# Altium schematic sheet USB 2 High Speed (OTG).SchDoc: USB 2.0 High speed (OTG)
size A3; DocumentNumber: 8; Revision: A; SheetNumber: 8; SheetTotal: 10
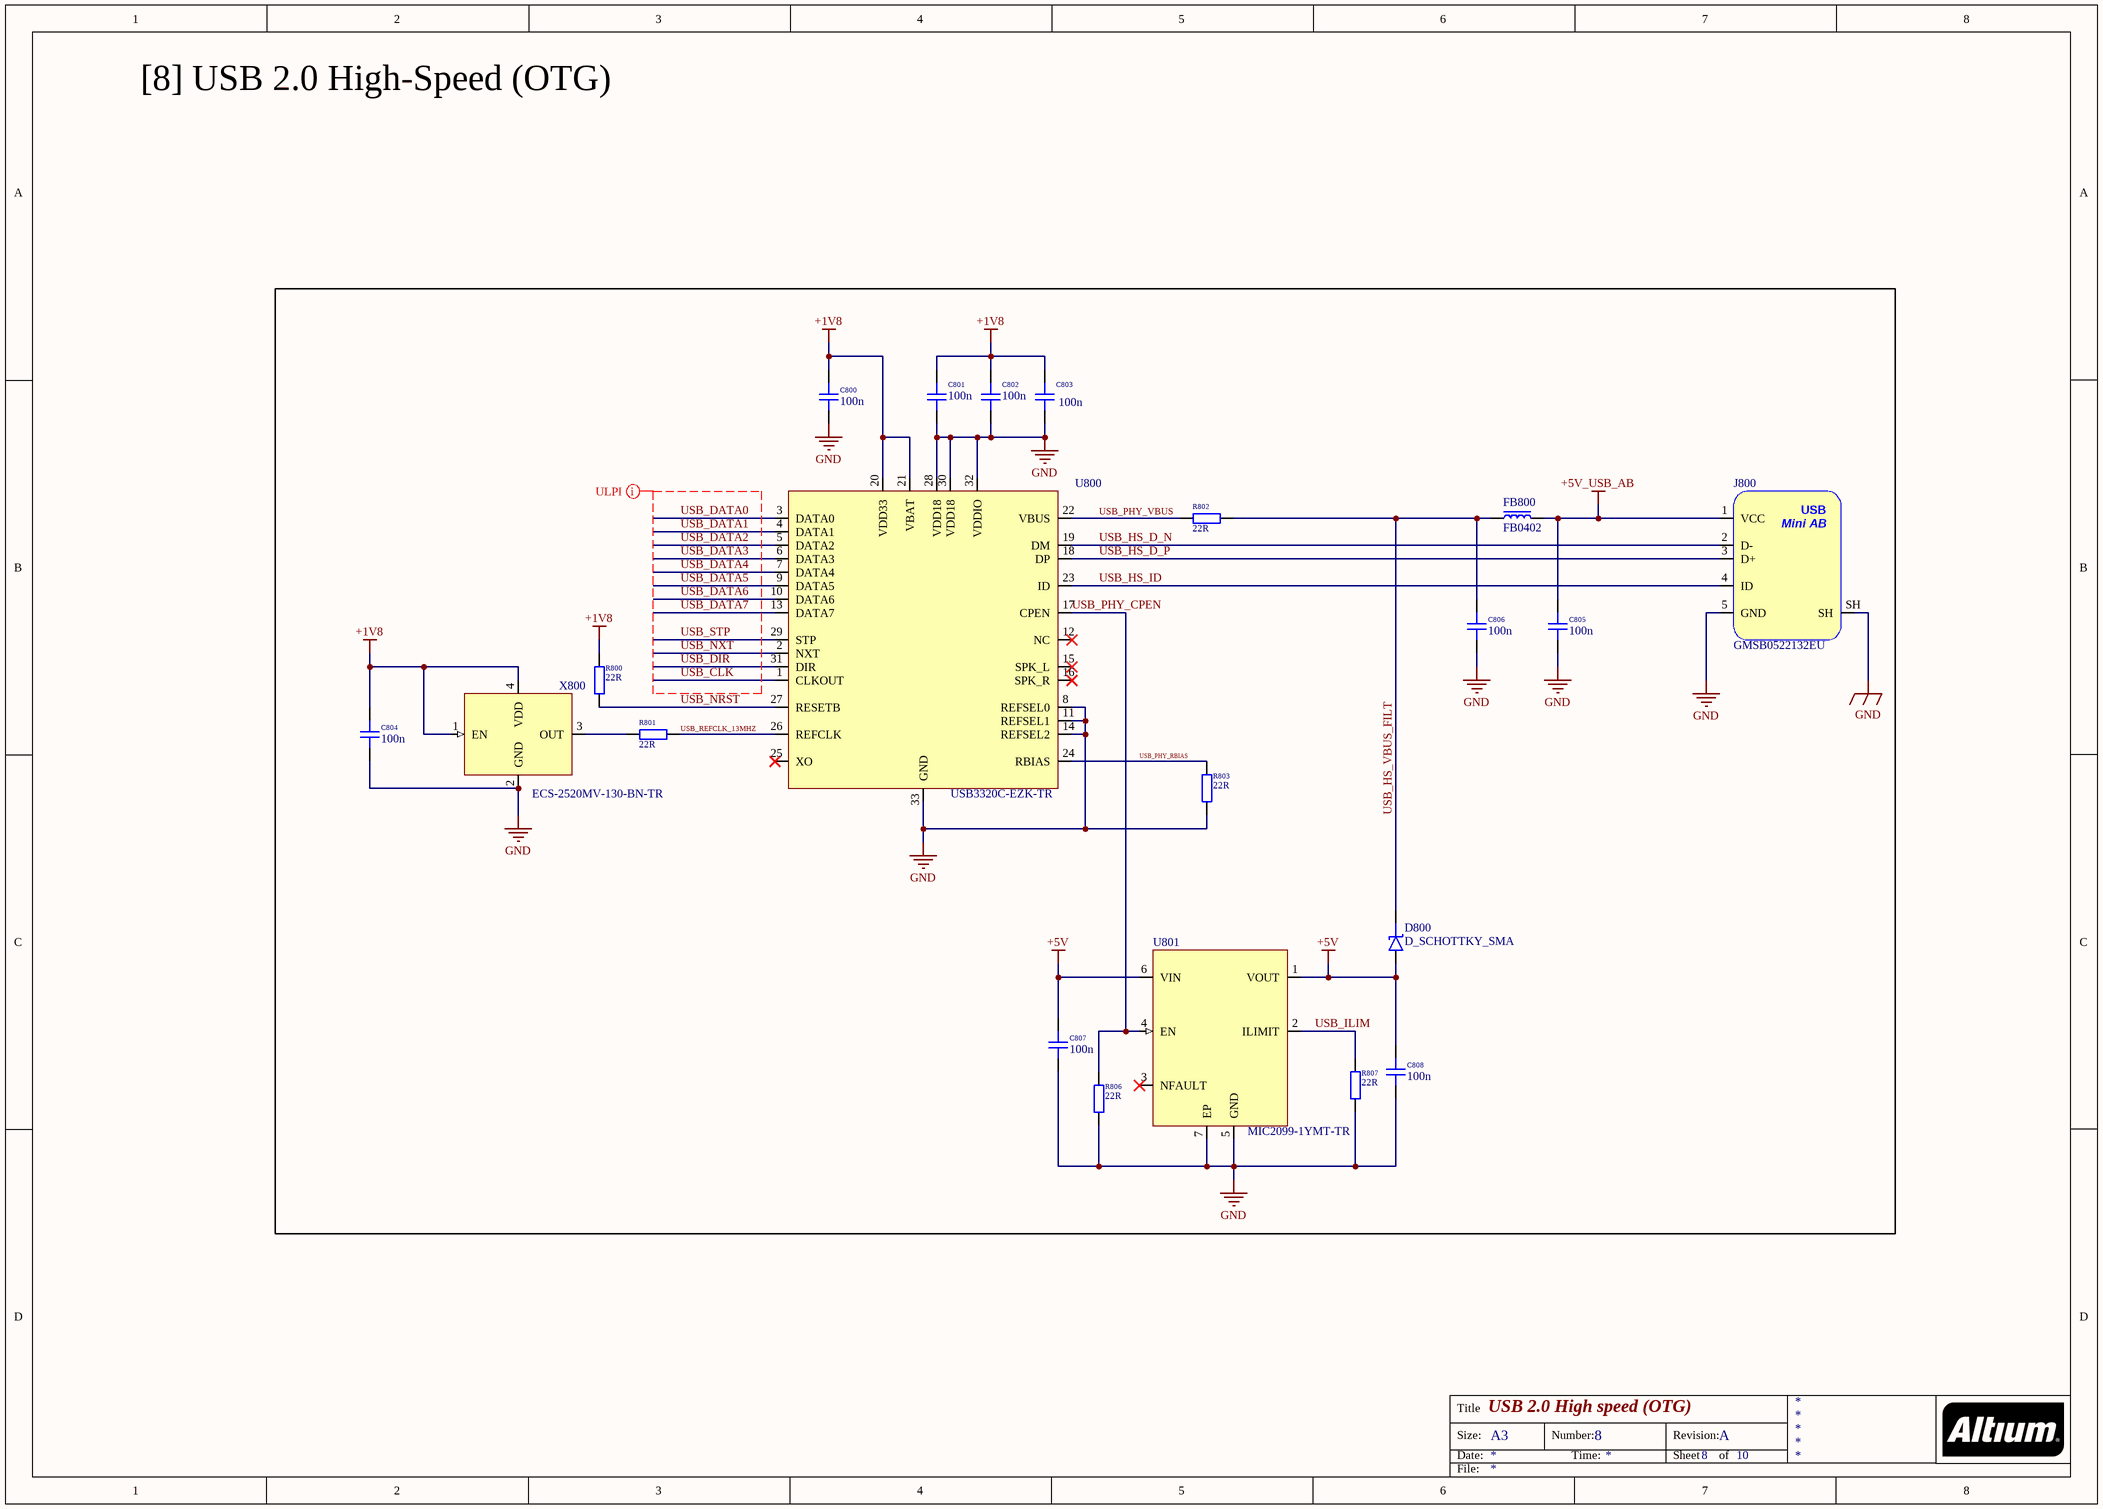
[diagram p0: USB 2 High Speed (OTG).SchDoc]

## Parts
C800  100n  [CAP_1210]
C801  100n  [CAP_1210]
C802  100n  [CAP_1210]
C803  100n  [CAP_1210]
C804  100n  [CAP_1210]
C805  100n  [CAP_1210]
C806  100n  [CAP_1210]
C807  100n  [CAP_1210]
C808  100n  [CAP_1210]
D800  D_SCHOTTKY_SMA  [DO-214AC-2 (SMA)]
FB800  FB0402  [FB_0402]
J800  GMSB0522132EU  [GMSB0522132EU]
R800  22R  [RES_0402]
R801  22R  [RES_0402]
R802  22R  [RES_0402]
R803  22R  [RES_0402]
R806  22R  [RES_0402]
R807  22R  [RES_0402]
U800  USB3320C-EZK-TR  [QFN-32-5x5x0.85mm]
U801  MIC2099-1YMT-TR  [TMLF-6-1_6X1_6]
X800  ECS-2520MV-130-BN-TR  [XTAL_2520]

## Nets
+1V8: C800.2 C801.2 C802.2 C803.2 C804.2 R800.1 U800.20(VDD33) U800.21(VBAT) X800.1(EN) X800.4(VDD)
+5V: C807.2 C808.2 D800.A U801.1(VOUT) U801.6(VIN)
+5V_USB_AB: C805.2 FB800.2 J800.1(VCC)
GND: C800.1 C801.1 C802.1 C803.1 C804.1 C805.1 C806.1 C807.1 C808.1 J800.5(GND) J800.SH R803.2 R806.2 R807.2 U800.8(REFSEL0) U800.11(REFSEL1) U800.14(REFSEL2) U800.28(VDD18) U800.30(VDD18) U800.32(VDDIO) U800.33(GND) U801.5(GND) U801.7(EP) X800.2(GND)
USB_CLK: U800.1(CLKOUT)
USB_DATA0: U800.3(DATA0)
USB_DATA1: U800.4(DATA1)
USB_DATA2: U800.5(DATA2)
USB_DATA3: U800.6(DATA3)
USB_DATA4: U800.7(DATA4)
USB_DATA5: U800.9(DATA5)
USB_DATA6: U800.10(DATA6)
USB_DATA7: U800.13(DATA7)
USB_DIR: U800.31(DIR)
USB_HS_D_N: J800.2(D-) U800.19(DM)
USB_HS_D_P: J800.3(D+) U800.18(DP)
USB_HS_ID: J800.4(ID) U800.23(ID)
USB_HS_VBUS_FILT: C806.2 D800.K FB800.1 R802.1
USB_ILIM: R807.1 U801.2(ILIMIT)
USB_NRST: R800.2 U800.27(RESETB)
USB_NXT: U800.2(NXT)
USB_PHY_CPEN: R806.1 U800.17(CPEN) U801.4(EN)
USB_PHY_RBIAS: R803.1 U800.24(RBIAS)
USB_PHY_VBUS: R802.2 U800.22(VBUS)
USB_REFCLK_13MHZ: R801.1 U800.26(REFCLK)
USB_STP: U800.29(STP)
NetR801_2: R801.2 X800.3(OUT)

Not connected (* = marked no-connect by the designer): U800 12(NC)* 15(SPK_L)* 16(SPK_R)* 25(XO)*; U801 3(NFAULT)*

## Layout directives
mark named ULPI: USB_CLK, USB_DATA0, USB_DATA1, USB_DATA2, USB_DATA3, USB_DATA4, USB_DATA5, USB_DATA6, USB_DATA7, USB_DIR, USB_NXT, USB_STP

## Notes on the sheet
- [8] USB 2.0 High-Speed (OTG)
- Title
- Size:
- Date:
- A3
- Number:
- Time:
- Revision:
- Sheet
- of
- File:
- (in symbol GMSB0522132EU) USB; Mini AB

## Library data of the parts
C800-C808 = CAP_1210: Capacitor SMD 1210; Manufacturer: *; Manufacturer Part Number: *; Distributor Link: *; LCSC: *; Rating: *; Dielectric: *
D800 = D_SCHOTTKY_SMA: Diode Schottky SMD SMA (DO-214AA)
FB800 = FB_0402: Ferrite Bead SMD 0402; Manufacturer: *; Manufacturer Part Number: *; Distributor Link: *; LCSC: *
J800 = GMSB0522132EU: USB 2.0 Mini AB Receptacle Right Angle Through-Hole; Manufacturer: Amphenol; Manufacturer Part Number: GMSB0522132EU
R800-R803 R806 R807 = RES_0402: Resistor SMD 0402; Manufacturer: *; Manufacturer Part Number: *; Distributor Link: *; LCSC: *
U800 = USB3320C-EZK-TR: Hi-Speed USB 2.0 ULPI Transceiver; Manufacturer: Microchip; Manufacturer Part Number: USB3320C-EZK-TR
U801 = MIC2099-1YMT-TR: Power Distribution Switch Resistor programmable current limit / – 0.1A to 1.1A 2.5V-5.5V; Manufacturer: Microchip; Manufacturer Part Number: MIC2099-1YMT-TR
X800 = ECS-2520MV-130-BN-TR: Standard Clock Oscillators XO (Standard),13MHz,Standby (Power Down),CMOS, Multi-Volt,1.6 V 3.6 V,+/-50ppm,-40 C 85 C,6mA,Surface Mount,4-SMD, No Lead,(2.50mm x 2.00mm),(0.80mm); Manufacturer: ECS; Manufacturer Part Number: ECS-2520MV-130-BN-TR